# Altium schematic sheet [21] - TEST POINTS.SchDoc
size A4; DrawnBy: Philip Rowse
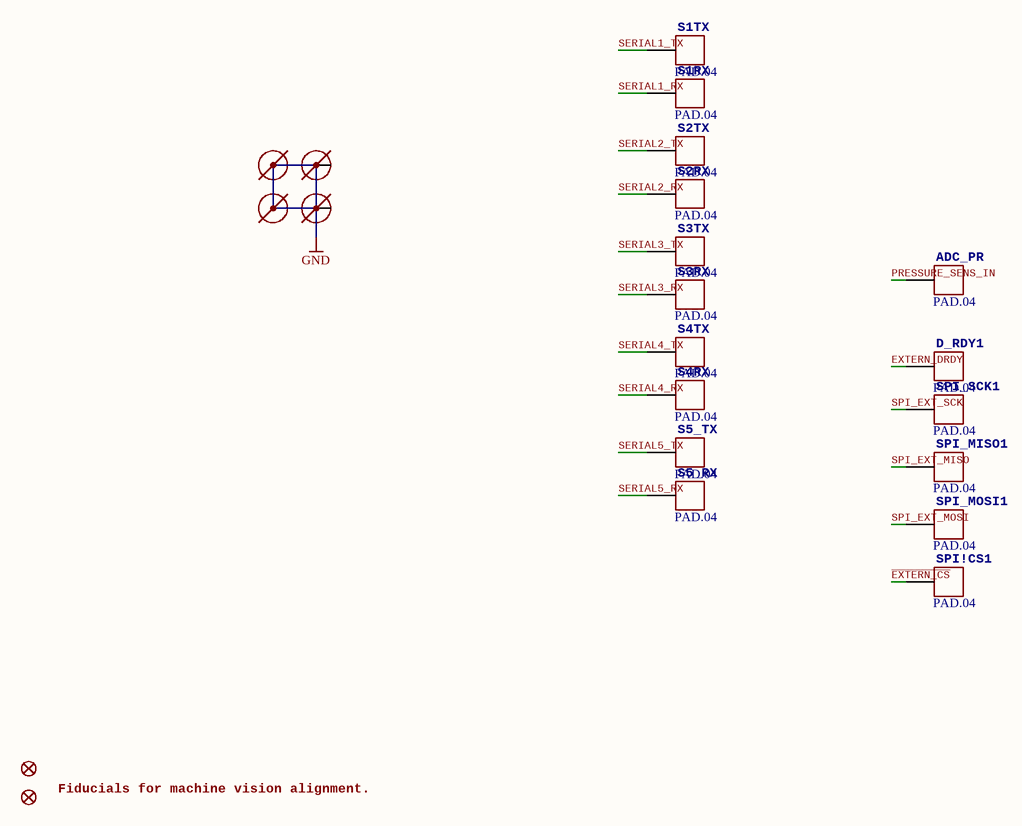
[diagram p0: [21] - TEST POINTS.SchDoc]

## Parts
ADC_PR  PAD.04  [PAD.04X.04]
D_RDY1  PAD.04  [PAD.04X.04]
JP400  FIDUCIAL1.5X3  [FIDUCIAL-1.5X3]  (value not drawn)
JP401  FIDUCIAL1.5X3  [FIDUCIAL-1.5X3]  (value not drawn)
M3_MOUNT901  MOUNT-HOLE1.8MM  [MOUNT-HOLE1.8]  (value not drawn)
M3_MOUNT902  MOUNT-HOLE1.8MM  [MOUNT-HOLE1.8]  (value not drawn)
M3_MOUNT903  MOUNT-HOLE1.8MM  [MOUNT-HOLE1.8]  (value not drawn)
M3_MOUNT904  MOUNT-HOLE1.8MM  [MOUNT-HOLE1.8]  (value not drawn)
S1RX  PAD.04  [PAD.04X.04]
S1TX  PAD.04  [PAD.04X.04]
S2RX  PAD.04  [PAD.04X.04]
S2TX  PAD.04  [PAD.04X.04]
S3RX  PAD.04  [PAD.04X.04]
S3TX  PAD.04  [PAD.04X.04]
S4RX  PAD.04  [PAD.04X.04]
S4TX  PAD.04  [PAD.04X.04]
S5_RX  PAD.04  [PAD.04X.04]
S5_TX  PAD.04  [PAD.04X.04]
SPI!CS1  PAD.04  [PAD.04X.04]
SPI_MISO1  PAD.04  [PAD.04X.04]
SPI_MOSI1  PAD.04  [PAD.04X.04]
SPI_SCK1  PAD.04  [PAD.04X.04]

## Nets
GND: M3_MOUNT901.1 M3_MOUNT902.1 M3_MOUNT903.1 M3_MOUNT904.1
~{EXTERN_CS}: SPI!CS1.P$1
EXTERN_DRDY: D_RDY1.P$1
PRESSURE_SENS_IN: ADC_PR.P$1
SERIAL1_RX: S1RX.P$1
SERIAL1_TX: S1TX.P$1
SERIAL2_RX: S2RX.P$1
SERIAL2_TX: S2TX.P$1
SERIAL3_RX: S3RX.P$1
SERIAL3_TX: S3TX.P$1
SERIAL4_RX: S4RX.P$1
SERIAL4_TX: S4TX.P$1
SERIAL5_RX: S5_RX.P$1
SERIAL5_TX: S5_TX.P$1
SPI_EXT_MISO: SPI_MISO1.P$1
SPI_EXT_MOSI: SPI_MOSI1.P$1
SPI_EXT_SCK: SPI_SCK1.P$1

## Notes on the sheet
- Fiducials for machine
  vision alignment.
- Title:
- Date:
- Time:
- https://creativecommons.org/publicdomain/zero/1.0/
- Sheet:
- Approved:
- of:
- Drawn By:
- Checked By:
- ProfiCNC

## Library data of the parts
ADC_PR D_RDY1 S1RX S1TX S2RX S2TX S3RX S3TX S4RX S4TX S5_RX S5_TX SPI!CS1 SPI_MISO1 SPI_MOSI1 SPI_SCK1 = PAD.04: Manufacturer 1: DNF; Supplier Unit Price 1: 0; Supplier 1: DNF; Supplier Part Number 1: DNF
JP400 JP401 = FIDUCIAL1.5X3: <b>Fiducial Alignment Points</b> / Various fiducial points for machine vision alignment.; BOM: EXCLUDE; PARTNO: *